# Altium project Proyecto.PrjPCB
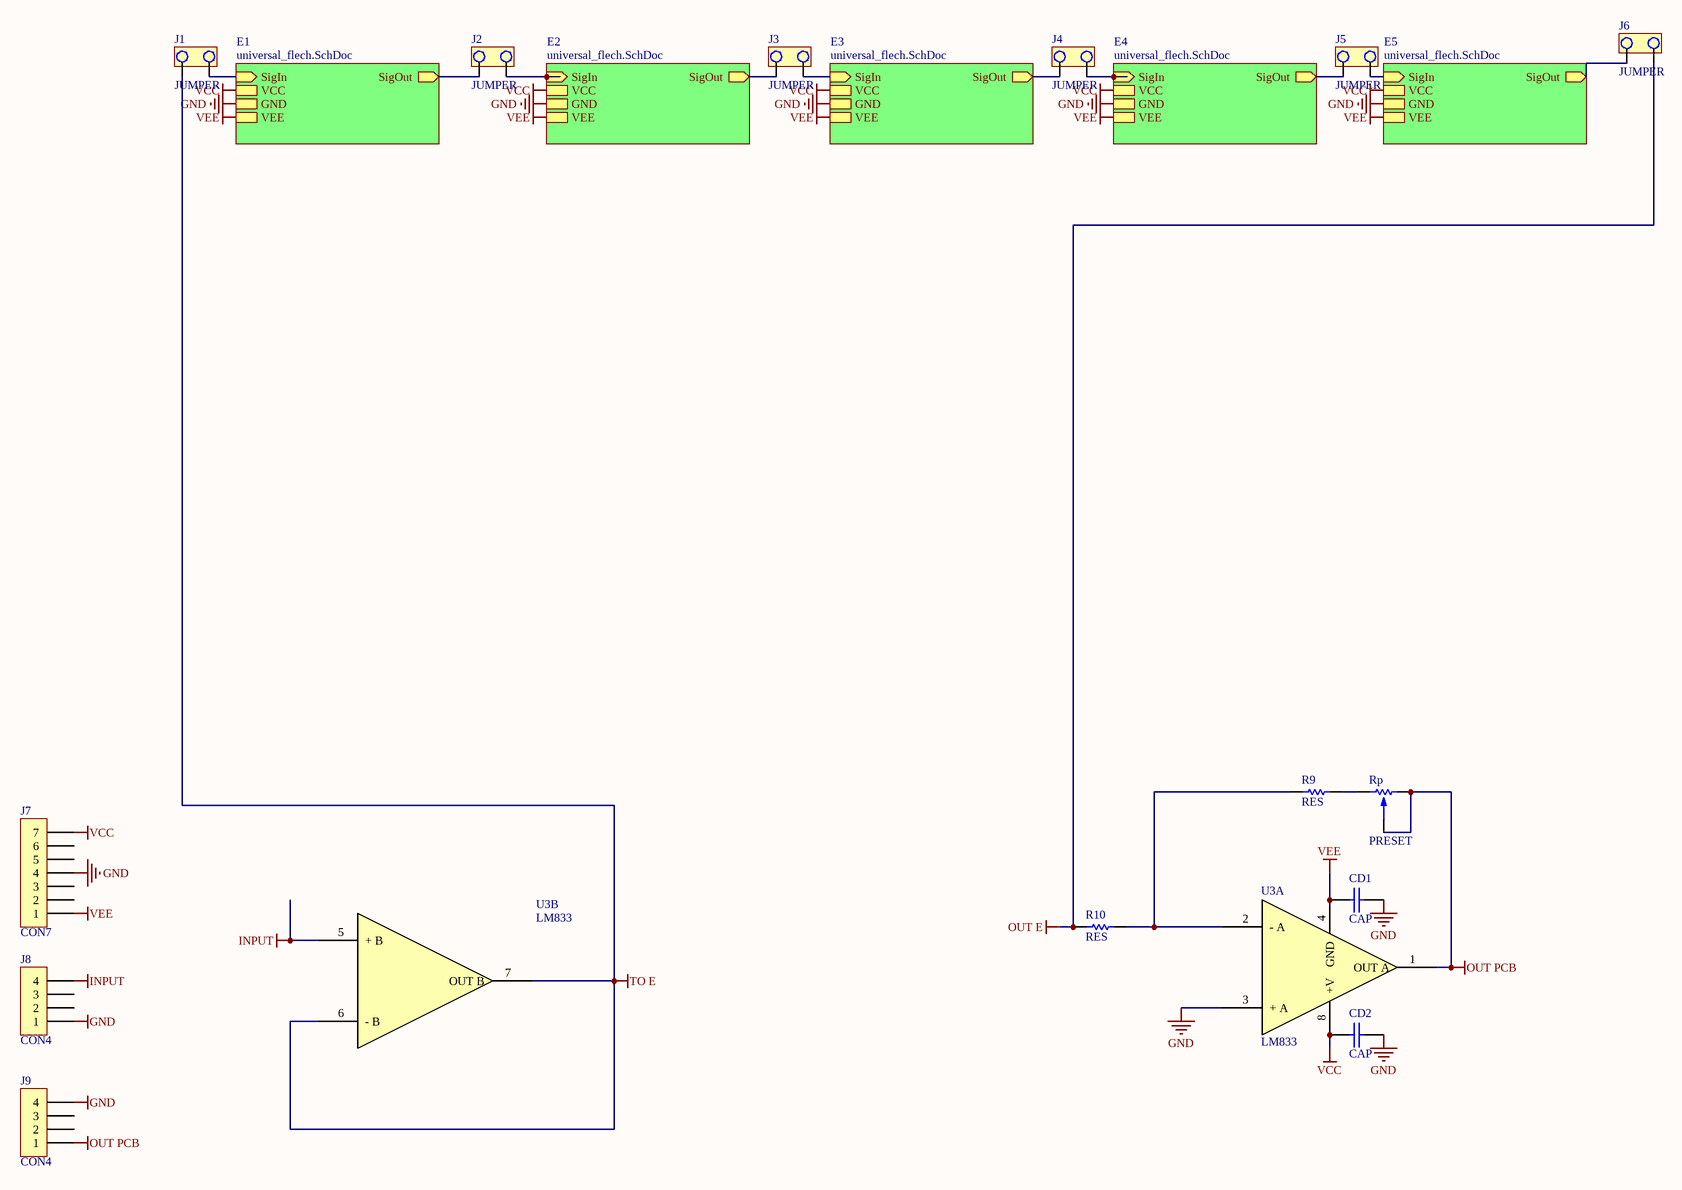
[diagram p0: Esquemático.SchDoc]
2 sheets, 95 parts. Net scope: hierarchical (ports join the sheet entries above them; power ports are global).
Board file: PCB1.PcbDoc
Sheets:
  Esquemático.SchDoc
    E1 = universal_flech.SchDoc
    E2 = universal_flech.SchDoc
    E3 = universal_flech.SchDoc
    E4 = universal_flech.SchDoc
    E5 = universal_flech.SchDoc

## Sheet Esquemático.SchDoc
size A2

### Parts
(Parts that share a designator on the sheet are numbered #1, #2 ... from top to bottom, then left to right.)
CD1#1  CAP  [CAP200]
CD2#1  CAP  [CAP200]
J1  JUMPER  [JUMPER2]
J2  JUMPER  [JUMPER2]
J3  JUMPER  [JUMPER2]
J4  JUMPER  [JUMPER2]
J5  JUMPER  [JUMPER2]
J6  JUMPER  [JUMPER2]
J7  CON7  [SIP7]
J8  CON4  [SIP4]
J9  CON4  [SIP4]
R9  RES  [0805]
R10  RES  [0805]
Rp  PRESET  [PRESET V]
U3  LM833  [DIP8]  (parts A,B of 2)

### Sub-sheets
E1 = universal_flech.SchDoc: SigIn (in), SigOut (out), VCC, GND, VEE
E2 = universal_flech.SchDoc: SigIn (in), SigOut (out), VCC, GND, VEE
E3 = universal_flech.SchDoc: SigIn (in), SigOut (out), VCC, GND, VEE
E4 = universal_flech.SchDoc: SigIn (in), SigOut (out), VCC, GND, VEE
E5 = universal_flech.SchDoc: SigIn (in), SigOut (out), VCC, GND, VEE

### Nets
GND: CD1#1.2 CD2#1.2 J7.4 J8.1 J9.4 U3.3(+_A) ; sheet E1/GND, sheet E2/GND, sheet E3/GND, sheet E4/GND, sheet E5/GND
INPUT: J8.4 U3.5(+_B)
OUT E: J6.1 R10.1
OUT PCB: J9.1 Rp.1 Rp.2 U3.1(OUT_A)
TO E: J1.2 U3.6(-_B) U3.7(OUT_B)
VCC: CD2#1.1 J7.7 U3.8(+V) ; sheet E1/VCC, sheet E2/VCC, sheet E3/VCC, sheet E4/VCC, sheet E5/VCC
VEE: CD1#1.1 J7.1 U3.4(GND) ; sheet E1/VEE, sheet E2/VEE, sheet E3/VEE, sheet E4/VEE, sheet E5/VEE
NetJ1_1: J1.1 ; sheet E1/SigIn
NetJ2_1: J2.1 ; sheet E2/SigIn
NetJ2_2: J2.2 ; sheet E1/SigOut
NetJ3_1: J3.1 ; sheet E3/SigIn
NetJ3_2: J3.2 ; sheet E2/SigOut
NetJ4_1: J4.1 ; sheet E4/SigIn
NetJ4_2: J4.2 ; sheet E3/SigOut
NetJ5_1: J5.1 ; sheet E5/SigIn
NetJ5_2: J5.2 ; sheet E4/SigOut
NetJ6_2: J6.2 ; sheet E5/SigOut
NetR9_1: R9.1 R10.2 U3.2(-_A)
NetR9_2: R9.2 Rp.3

Not connected (* = marked no-connect by the designer): J7 2 3 5 6; J8 2 3; J9 2 3

### Library data of the parts
U3 = LM833: Dual Audio Operational Amplifier

## Sheet universal_flech.SchDoc
size A2
Used 5 times, as channels E1, E2, E3, E4, E5. Parts and nets are listed once, with the designators drawn on the sheet.
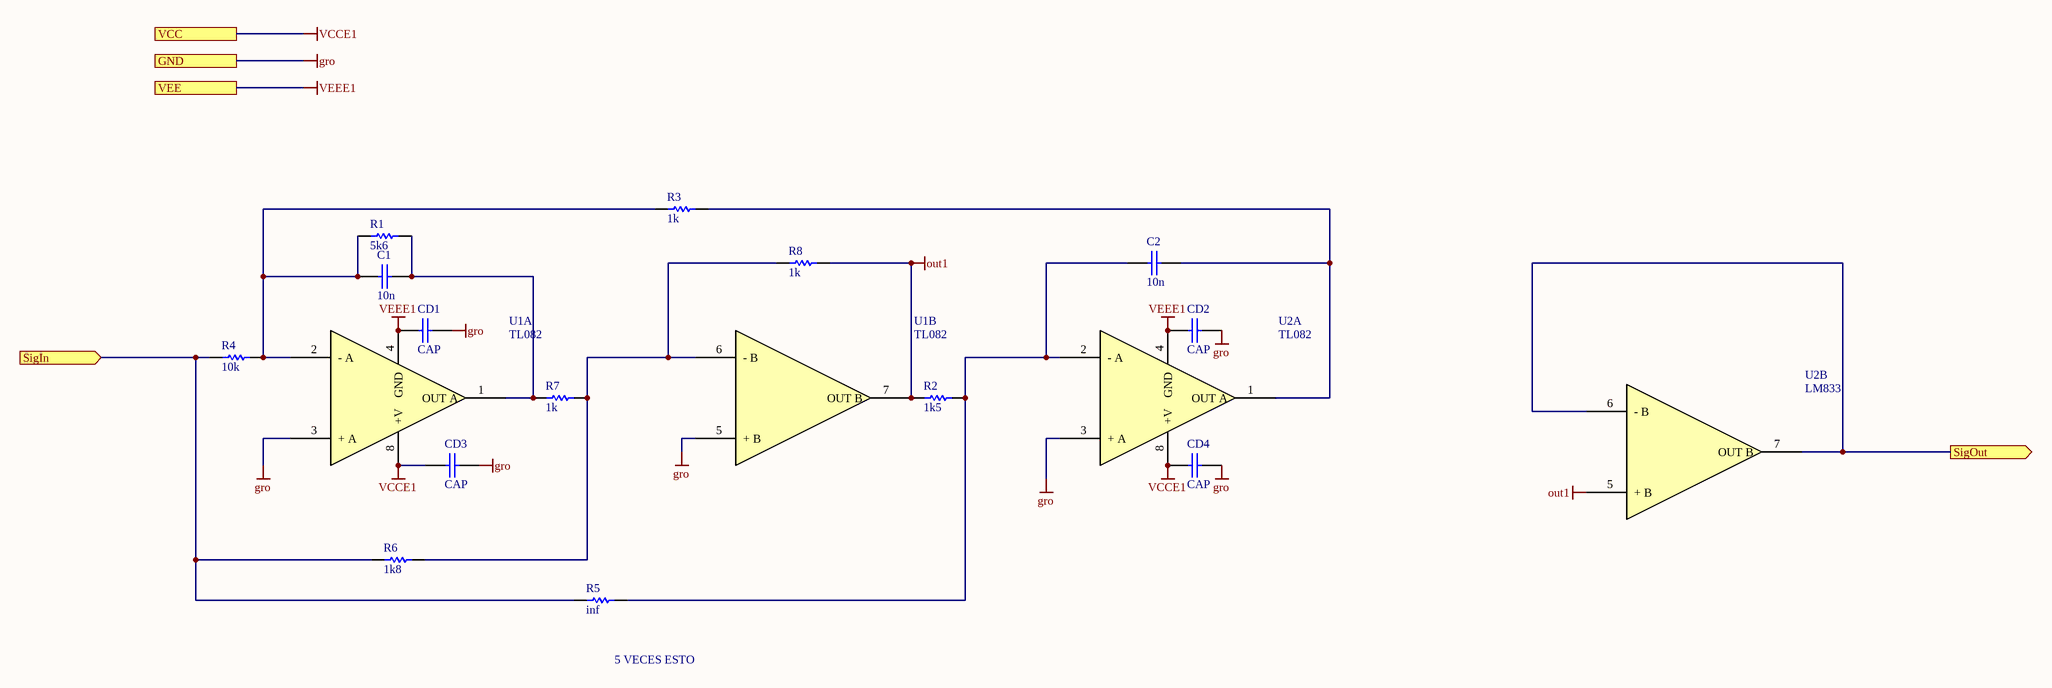
[diagram p1: universal_flech.SchDoc]

### Parts
C1  10n  [CAP200]
C2  10n  [CAP200]
CD1  CAP  [CAP200]
CD2  CAP  [CAP200]
CD3  CAP  [CAP200]
CD4  CAP  [CAP200]
R1  5k6  [0805]
R2  1k5  [0805]
R3  1k  [0805]
R4  10k  [0805]
R5  inf  [0805]
R6  1k8  [0805]
R7  1k  [0805]
R8  1k  [0805]
U1  TL082  [DIP8]  (parts A,B of 2)
U2  TL082  [DIP8]  (parts A,B of 2)

### Ports
GND, SigIn (in), SigOut (out), VCC, VEE

### Nets
gro: CD1.2 CD2.2 CD3.2 CD4.2 U1.3(+_A) U1.5(+_B) U2.3(+_A) ; port GND
out1: R2.1 R8.2 U1.7(OUT_B) U2.5(+_B)
VCCE1: CD3.1 CD4.1 U1.8(+V) U2.8(+V) ; port VCC
VEEE1: CD1.1 CD2.1 U1.4(GND) U2.4(GND) ; port VEE
SigIn: R4.1 R5.1 R6.1 ; port SigIn
SigOut: U2.6(-_B) U2.7(OUT_B) ; port SigOut
NetC1_1: C1.1 R1.1 R3.1 R4.2 U1.2(-_A)
NetC1_2: C1.2 R1.2 R7.1 U1.1(OUT_A)
NetC2_1: C2.1 R2.2 R5.2 U2.2(-_A)
NetC2_2: C2.2 R3.2 U2.1(OUT_A)
NetR6_2: R6.2 R7.2 R8.1 U1.6(-_B)

### Channels
E1: designators C1=C1 C2=C2 CD1=CD#1 CD2=CD#2 CD3=CD#3 CD4=CD#4 R1=R1_E1 R2=R2_E1 R3=R3_E1 R4=R4_E1 R5=R5_E1 R6=R6_E1 R7=R7_E1 R8=R8_E1 U1=U1 U2=U2; ports GND=GND SigIn=NetJ1_1 SigOut=NetJ2_2 VCC=VCC VEE=VEE
E2: designators C1=C1_2 C2=C2_E2 CD1=CD1#2 CD2=CD2#2 CD3=CD3#1 CD4=CD4#1 R1=R1_E2 R2=R2_E2 R3=R3_E2 R4=R4_E2 R5=R5_E2 R6=R6_E2 R7=R7_E2 R8=R8_E2 U1=U1_2 U2=U2_E2; ports GND=GND SigIn=NetJ2_1 SigOut=NetJ3_2 VCC=VCC VEE=VEE
E3: designators C1=C1_3 C2=C2_E3 CD1=CD1#3 CD2=CD2#3 CD3=CD3#2 CD4=CD4#2 R1=R1_E3 R2=R2_E3 R3=R3_E3 R4=R4_E3 R5=R5_E3 R6=R6_E3 R7=R7_E3 R8=R8_E3 U1=U1_E3 U2=U2_E3; ports GND=GND SigIn=NetJ3_1 SigOut=NetJ4_2 VCC=VCC VEE=VEE
E4: designators C1=C1_4 C2=C2_E4 CD1=CD1#4 CD2=CD2#4 CD3=CD3#3 CD4=CD4#3 R1=R1_E4 R2=R2_E4 R3=R3_E4 R4=R4_E4 R5=R5_E4 R6=R6_E4 R7=R7_E4 R8=R8_E4 U1=U1_E4 U2=U2_E4; ports GND=GND SigIn=NetJ4_1 SigOut=NetJ5_2 VCC=VCC VEE=VEE
E5: designators C1=C1_E5 C2=C2_E5 CD1=CD1#5 CD2=CD2#5 CD3=CD3#4 CD4=CD4#4 R1=R1_E5 R2=R2_E5 R3=R3_E5 R4=R4_E5 R5=R5_E5 R6=R6_E5 R7=R7_E5 R8=R8_E5 U1=U1_E5 U2=U2_E5; ports GND=GND SigIn=NetJ5_1 SigOut=NetJ6_2 VCC=VCC VEE=VEE

### Notes on the sheet
- 5 VECES ESTO

### Library data of the parts
C1 C2 = CAP
R1-R8 = RES
U1 U2 = LM833: Dual Audio Operational Amplifier

## Nets that join several sheets
GND: Esquemático (6 pins), E1 (7 pins), E2 (7 pins), E3 (7 pins), E4 (7 pins), E5 (7 pins)
out1: E1 (R2_E1.1 R8_E1.2 U1.7 U2.5), E2 (R2_E2.1 R8_E2.2 U1_2.7 U2_E2.5), E3 (R2_E3.1 R8_E3.2 U1_E3.7 U2_E3.5), E4 (R2_E4.1 R8_E4.2 U1_E4.7 U2_E4.5), E5 (R2_E5.1 R8_E5.2 U1_E5.7 U2_E5.5)
VCC: Esquemático (CD2#1.1 J7.7 U3.8), E1 (CD#3.1 CD#4.1 U1.8 U2.8), E2 (CD3#1.1 CD4#1.1 U1_2.8 U2_E2.8), E3 (CD3#2.1 CD4#2.1 U1_E3.8 U2_E3.8), E4 (CD3#3.1 CD4#3.1 U1_E4.8 U2_E4.8), E5 (CD3#4.1 CD4#4.1 U1_E5.8 U2_E5.8)
VEE: Esquemático (CD1#1.1 J7.1 U3.4), E1 (CD#1.1 CD#2.1 U1.4 U2.4), E2 (CD1#2.1 CD2#2.1 U1_2.4 U2_E2.4), E3 (CD1#3.1 CD2#3.1 U1_E3.4 U2_E3.4), E4 (CD1#4.1 CD2#4.1 U1_E4.4 U2_E4.4), E5 (CD1#5.1 CD2#5.1 U1_E5.4 U2_E5.4)
NetJ1_1: Esquemático (J1.1), E1 (R4_E1.1 R5_E1.1 R6_E1.1)
NetJ2_1: Esquemático (J2.1), E2 (R4_E2.1 R5_E2.1 R6_E2.1)
NetJ2_2: Esquemático (J2.2), E1 (U2.6 U2.7)
NetJ3_1: Esquemático (J3.1), E3 (R4_E3.1 R5_E3.1 R6_E3.1)
NetJ3_2: Esquemático (J3.2), E2 (U2_E2.6 U2_E2.7)
NetJ4_1: Esquemático (J4.1), E4 (R4_E4.1 R5_E4.1 R6_E4.1)
NetJ4_2: Esquemático (J4.2), E3 (U2_E3.6 U2_E3.7)
NetJ5_1: Esquemático (J5.1), E5 (R4_E5.1 R5_E5.1 R6_E5.1)
NetJ5_2: Esquemático (J5.2), E4 (U2_E4.6 U2_E4.7)
NetJ6_2: Esquemático (J6.2), E5 (U2_E5.6 U2_E5.7)